# Altium schematic sheet Syncronus Buck.SchDoc
size 340 x 203 mm; Organization: Altium Limited; Address1: L3, 12a Rodborough Rd; Address2: Frenchs Forest; Address3: NSW; Address4: Australia 2086; SheetNumber: 2; SheetTotal: 7
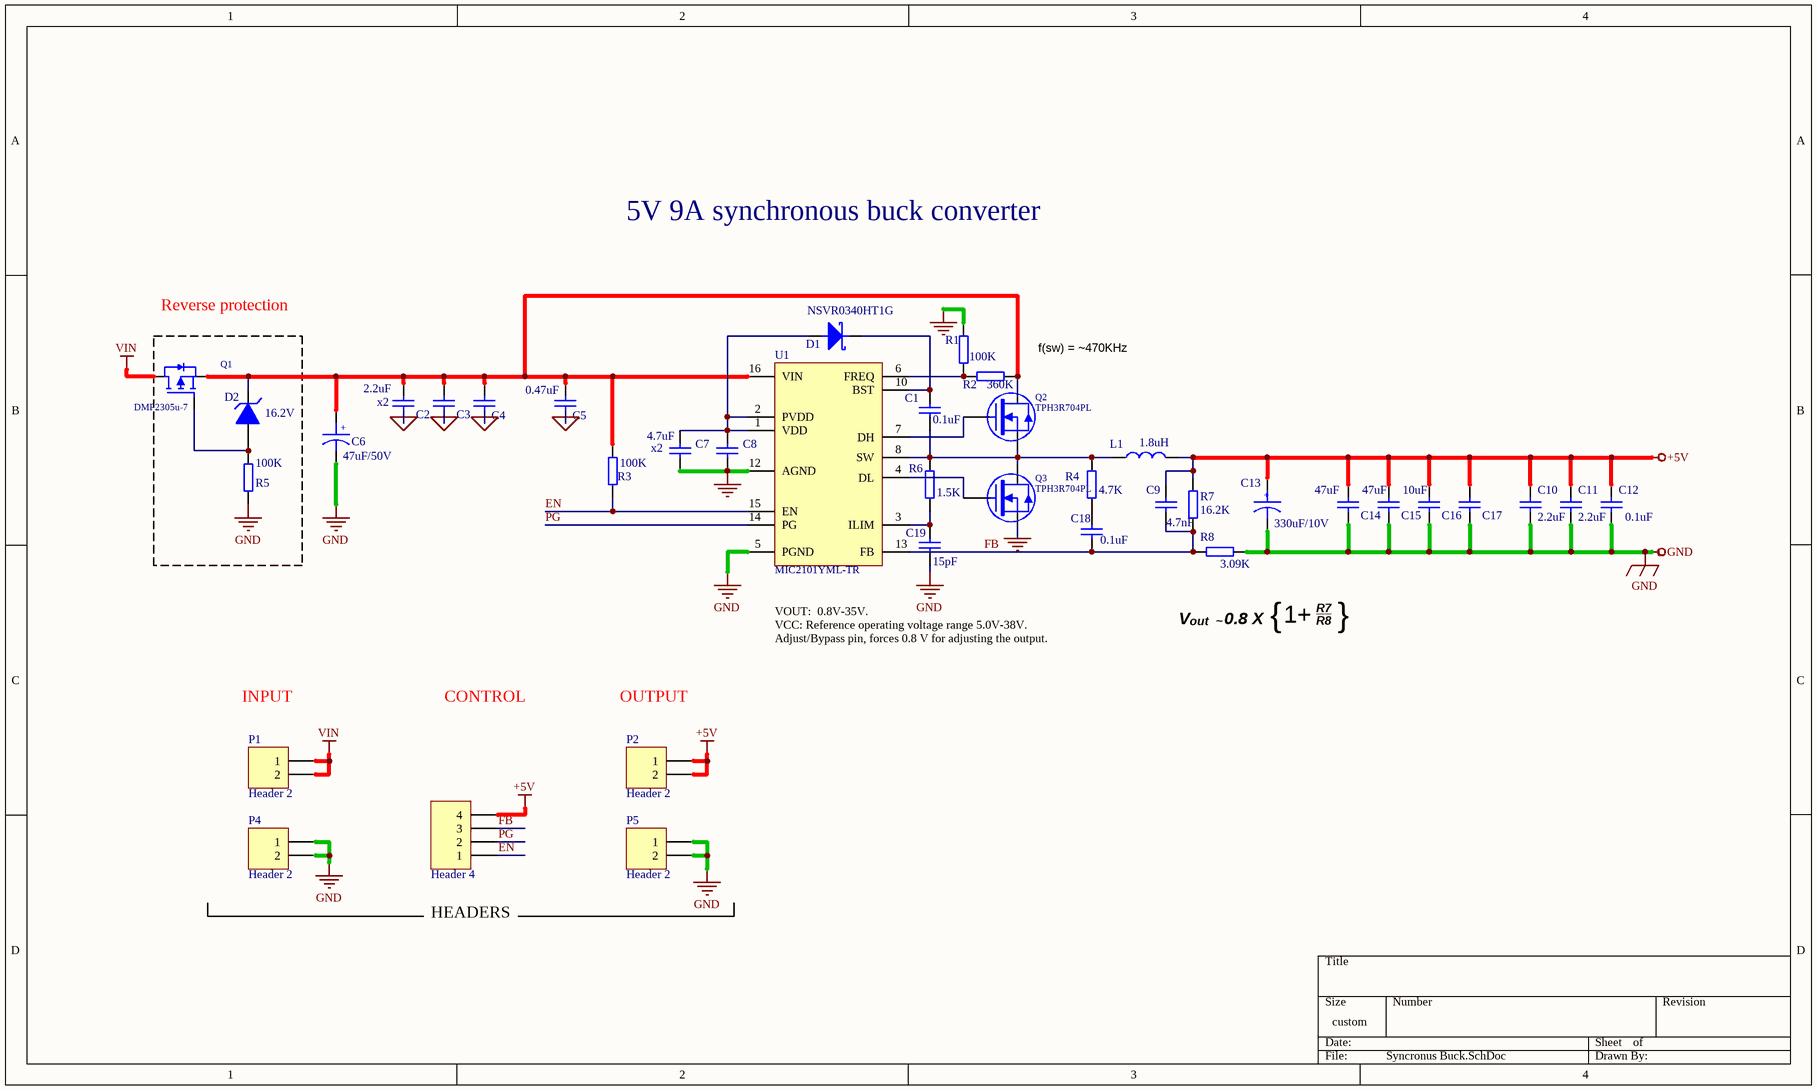
[diagram p0: Syncronus Buck.SchDoc]

## Parts
C1  100nF  [C0603-NO]  (value not drawn)
C2  2.2uF/50V  [C1206-NO]  (value not drawn)
C3  2.2uF/50V  [C1206-NO]  (value not drawn)
C4  2.2uF/50V  [C1206-NO]  (value not drawn)
C5  0.47uF/50V  [C0603-NO]  (value not drawn)
C6  47uF/50V  [CAP-SMD_BD6.3-L6.6-W6.6-FD-1]  (value not drawn)
C7  4.7uF/50V  [C0603-NO]  (value not drawn)
C8  4.7uF/50V  [C0603-NO]  (value not drawn)
C9  4.7nF  [C0603-NO]  (value not drawn)
C10  2.2uF/10V  [C0603-NO]  (value not drawn)
C11  2.2uF/10V  [C0603-NO]  (value not drawn)
C12  100nF/10V  [C0603-NO]  (value not drawn)
C13  330uF/10V  [CAP-SMD_BD6.3-L6.6-W6.6-FD-1]  (value not drawn)
C14  47uF/10V  [C1206-NO]  (value not drawn)
C15  47uF/10V  [C1206-NO]  (value not drawn)
C16  10uF/10V  [C0805-NO]  (value not drawn)
C17  10uF/10V  [C0805-NO]  (value not drawn)
C18  100nF  [C0603-NO]  (value not drawn)
C19  15pF  [C0603-NO]  (value not drawn)
D1  NSVR0340HT1G  [SOD-323]
D2  16.2V  [SOD-323]  (value not drawn)
L1  1.8uH  [INDUCTOR_7X7MM_SMD]  (value not drawn)
P1  Header 2  [HDR1X2]
P2  Header 2  [HDR1X2]
P3  Header 4  [HDR1X4]
P4  Header 2  [HDR1X2]
P5  Header 2  [HDR1X2]
Q1  DMP2305u-7  [POWERDI3333-8_L3.3-W3.3-P0.65-BL]
Q2  TPH3R704PL  [POWERDI3333-8_L3.3-W3.3-P0.65-BL]
Q3  TPH3R704PL  [POWERDI3333-8_L3.3-W3.3-P0.65-BL]
R1  100kΩ  [R0603-NO]  (value not drawn)
R2  360kΩ  [R0603-NO]  (value not drawn)
R3  100kΩ  [R0603-NO]  (value not drawn)
R4  4.7kΩ  [R0603-NO]  (value not drawn)
R5  100kΩ  [R0603-NO]  (value not drawn)
R6  1.5kΩ  [R0603-NO]  (value not drawn)
R7  16.2kΩ  [R0603-NO]  (value not drawn)
R8  3.09kΩ  [R0603-NO]  (value not drawn)
U1  MIC2101YML-TR  [VQFN-16_L3.0-W3.0-P0.50-BL-EP1.7]

## Nets
+5V: C9.1 C10.1 C11.1 C12.1 C13.1(+) C14.1 C15.1 C16.1 C17.1 L1.1 P2.1 P2.2 P3.4 R7.2
GND: C2.2 C3.2 C4.2 C5.2 C6.2(-) C7.2 C8.2 C10.2 C11.2 C12.2 C13.2(-) C14.2 C15.2 C16.2 C17.2 C19.2 P4.1 P4.2 P5.1 P5.2 Q3.2(S) R1.1 R5.1 R8.1 U1.5(PGND) U1.12(AGND) U1.17(GND)
VIN: P1.1 P1.2 Q1.3(D)
EN: P3.1 R3.2 U1.15(EN)
FB: C9.2 C18.1 P3.3 R7.1 R8.2 U1.13(FB)
PG: P3.2 U1.14(PG)
NetC1_1: C1.1 D1.K(C) U1.10(BST)
NetC1_2: C1.2 L1.2 Q2.2(S) Q3.3(D) R4.2 R6.2 U1.8(SW)
NetC2_1: C2.1 C3.1 C4.1 C5.1 C6.1(+) D2.K Q1.2(S) Q2.3(D) R2.2 R3.1 U1.16(VIN)
NetC7_1: C7.1 C8.1 D1.A U1.1(VDD) U1.2(PVDD)
NetC18_2: C18.2 R4.1
NetC19_1: C19.1 R6.1 U1.3(ILIM)
NetD2_A: D2.A Q1.1(G) R5.2
NetQ2_1: Q2.1(G) U1.7(DH)
NetQ3_1: Q3.1(G) U1.4(DL)
NetR1_2: R1.2 R2.1 U1.6(FREQ)

## Notes on the sheet
- 5V 9A synchronous buck converter
- Reverse protection
- 100K
- f(sw) = ~470KHz
- (near D2) 16.2V
- (near C2) 2.2uF
- (near C2) x2
- (near C5) 0.47uF
- (near C7) 4.7uF
- (near C1) 0.1uF
- (near R2) 360K
- (near R5) 100K
- (near C6) 47uF/50V
- (near R3) 100K
- (near C7) x2
- (near R6) 1.5K
- (near R4) 4.7K
- (near L1) 1.8uH
- (near C14) 47uF
- (near C15) 47uF
- (near C16) 10uF
- (near C19) 15pF
- (near C18) 0.1uF
- (near R7) 4.7nF
- (near R7) 16.2K
- (near R8) 3.09K
- (near C13) 330uF/10V
- 2.2uF
- (near C12) 0.1uF
- VCC: Reference operating voltage range 5.0V-38V.
- VOUT:  0.8V-35V.
- V
- out  ~
- 0.8 X
- {
- 1+
- R7
- R8
- }
- INPUT
- CONTROL
- OUTPUT
- Adjust/Bypass pin, forces 0.8 V for adjusting the output.
- (near P3) HEADERS

## Library data of the parts
C1 C5 C7-C12 C18 C19 = Cap_0603: Capacitor, X5R, ±10%, 6.3V; Part Number: C0603-N.C.; Manufacturer: N.A.; Artikkelnr Noca: 20069060; Datasheet: *; LatestRevisionDate: 2009-11-23; Pin Count: 2; Publisher: Nordic Semiconductor; Published: 2009-05-08; Volts: 6.3V; Supplier: *; Supplier part number: *; 2nd source Supplier: *; 2nd source part number: *; Footprint Doc: 0603; Artikkelnr Simpro: N.A.; Manufacturer Part Number: N.A.
  C1 C18: Value: 100nF
  C5: Value: 0.47uF/50V
  C7 C8: Value: 4.7uF/50V
  C9: Value: 4.7nF
  C10 C11: Value: 2.2uF/10V
  C12: Value: 100nF/10V
  C19: Value: 15pF
C2-C4 C14 C15 = Cap_1206: Capacitor, X5R, ±10%, 6.3V; Manufacturer: N.A.; Specification: X7R, ±10%, 16V
C6 C13 = CAP-ELECT-SMD: Smd Aluminum Electrolytic Capacitor
C16 C17 = Cap_0805: Capacitor, X5R, ±10%, 6.3V; Manufacturer: N.A.; Specification: X7R, ±10%, 16V
D1 = DIODE-NSVR0340HT1G: Schottky Diode / NSVR0340HT1G
D2 = DIODE-Zener: Zener Diode; Published: 8-Jun-2000; LatestRevisionDate: 17-Jul-2002; LatestRevisionNote: Re-released for DXP Platform.; PackageReference: DIODE-0.7; Publisher: Altium Limited; PackageDescription: Diode, Thru-Hole; 2 Leads; 0.7 in Pin Spacing
L1 = Inductor: SMD Inductor 7x7MM
P1 P2 P4 P5 = Header 2: Header, 2-Pin; LatestRevisionDate: 17-Jul-2002; LatestRevisionNote: Re-released for DXP Platform.; Publisher: Altium Limited
P3 = Header 4: Header, 4-Pin; LatestRevisionDate: 17-Jul-2002; LatestRevisionNote: Re-released for DXP Platform.; Publisher: Altium Limited
Q1 = MOSFET-DMP4025SFG: P Channel Mosfet
Q2 Q3 = MOSFET-AON7212: N Channel Mosfet 40V 92A dfn-8
R1-R3 R5 = Res_0603: Chip Resistor, ±1%, 0.100W; Part Number: R0603-N.C.Ω; Artikkelnr Noca: N.A.; Manufacturer: *; Manufacturer Part Number: *; Datasheet: *; Footprint Doc: 0603; LatestRevisionDate: 2009-05-08; Pin Count: 2; Publisher: Nordic Semiconductor; Published: 2009-05-08; Note: Chip Res; Supplier: *; Supplier part number: *; 2nd source Supplier: *; 2nd source part number: *; Artikkelnr Simpro: N.A.
  R1 R3 R5: Value: 100kΩ
  R2: Value: 360kΩ
R4 R6-R8 = Res_0603: Resistor, ±1%, 0.100W; Part Number: R0603-N.C.Ω; Manufacturer: N.A.; Note: Chip Res; Manufacturer Part Number: N.A.; Datasheet: *; Footprint Doc: 0603; LatestRevisionDate: 2009-05-08; Pin Count: 2; Publisher: Nordic Semiconductor; Published: 2009-05-08; Supplier: *; Supplier part number: *; 2nd source Supplier: *; 2nd source part number: *; Artikkelnr Noca: N.A.; Artikkelnr Simpro: N.A.
  R4: Value: 4.7kΩ
  R6: Value: 1.5kΩ
  R7: Value: 16.2kΩ
  R8: Value: 3.09kΩ
U1 = MIC2101YML-TR: DC-DC Converters MLF-16; Manufacturer: MICROCHIP(美国微芯); Contributor: lcsc; Supplier: LCSC; Supplier Part: C621528; Manufacturer Part: MIC2101YML-TR; spicePre: U; spiceSymbolName: MIC2101YML-TR